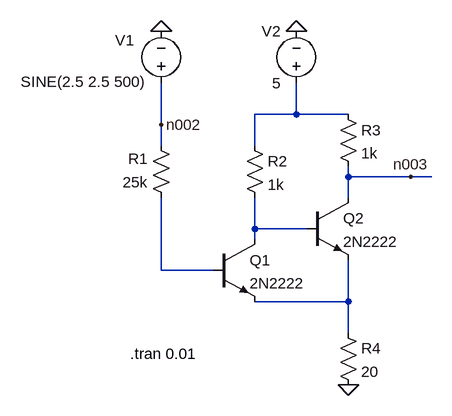
[diagram p0: schematic c02fig13.asc]
c02fig13.asc, the LTspice schematic file:
Version 4
SHEET 1 1104 680
WIRE 880 -48 880 -96
WIRE 880 -48 816 -48
WIRE 960 -48 880 -48
WIRE 672 -32 672 -96
WIRE 672 0 672 -32
WIRE 816 0 816 -48
WIRE 960 48 960 32
WIRE 1056 48 960 48
WIRE 1088 48 1056 48
WIRE 960 80 960 48
WIRE 816 128 816 80
WIRE 896 128 816 128
WIRE 816 144 816 128
WIRE 672 192 672 80
WIRE 752 192 672 192
WIRE 960 240 960 176
WIRE 960 240 816 240
WIRE 960 288 960 240
FLAG 960 368 0
FLAG 672 -176 0
FLAG 880 -176 0
FLAG 1056 48 n003
FLAG 672 -32 n002
SYMBOL res 688 96 R180
WINDOW 0 36 76 Left 2
WINDOW 3 36 40 Left 2
SYMATTR InstName R1
SYMATTR Value 25k
SYMBOL npn 752 144 R0
SYMATTR InstName Q1
SYMATTR Value 2N2222
SYMBOL npn 896 80 R0
SYMATTR InstName Q2
SYMATTR Value 2N2222
SYMBOL res 800 -16 R0
SYMATTR InstName R2
SYMATTR Value 1k
SYMBOL res 944 -64 R0
SYMATTR InstName R3
SYMATTR Value 1k
SYMBOL res 944 272 R0
SYMATTR InstName R4
SYMATTR Value 20
SYMBOL voltage 672 -80 R180
WINDOW 0 71 82 Right 2
WINDOW 3 216 18 Right 2
WINDOW 123 0 0 Left 0
WINDOW 39 0 0 Left 0
SYMATTR InstName V1
SYMATTR Value SINE(2.5 2.5 500)
SYMBOL voltage 880 -80 R180
WINDOW 0 24 96 Left 2
WINDOW 3 24 16 Left 2
WINDOW 123 0 0 Left 0
WINDOW 39 0 0 Left 0
SYMATTR InstName V2
SYMATTR Value 5
TEXT 624 320 Left 2 !.tran 0.01

The netlist it stands for:
* c02fig13.asc
R1 N005 n002 25k
Q1 N004 N005 N006 0 2N2222
Q2 n003 N004 N006 0 2N2222
R2 N001 N004 1k
R3 N001 n003 1k
R4 N006 0 20
V1 n002 0 SINE(2.5 2.5 500)
V2 N001 0 5
.model NPN NPN
.model PNP PNP
.lib standard.bjt
.tran 0.01
.backanno
.end